# Altium schematic sheet CW342_FPGAIO_1.SchDoc: <Enter Sheet Title>
size Letter; Organization: NewAE Technology Inc.; Address1: 1083 Queen St., Suite 196; Address2: Halifax; Address3: NS; Address4: Canada B3H 0B2; SheetNumber: 3; SheetTotal: 9; SheetApproved: NO
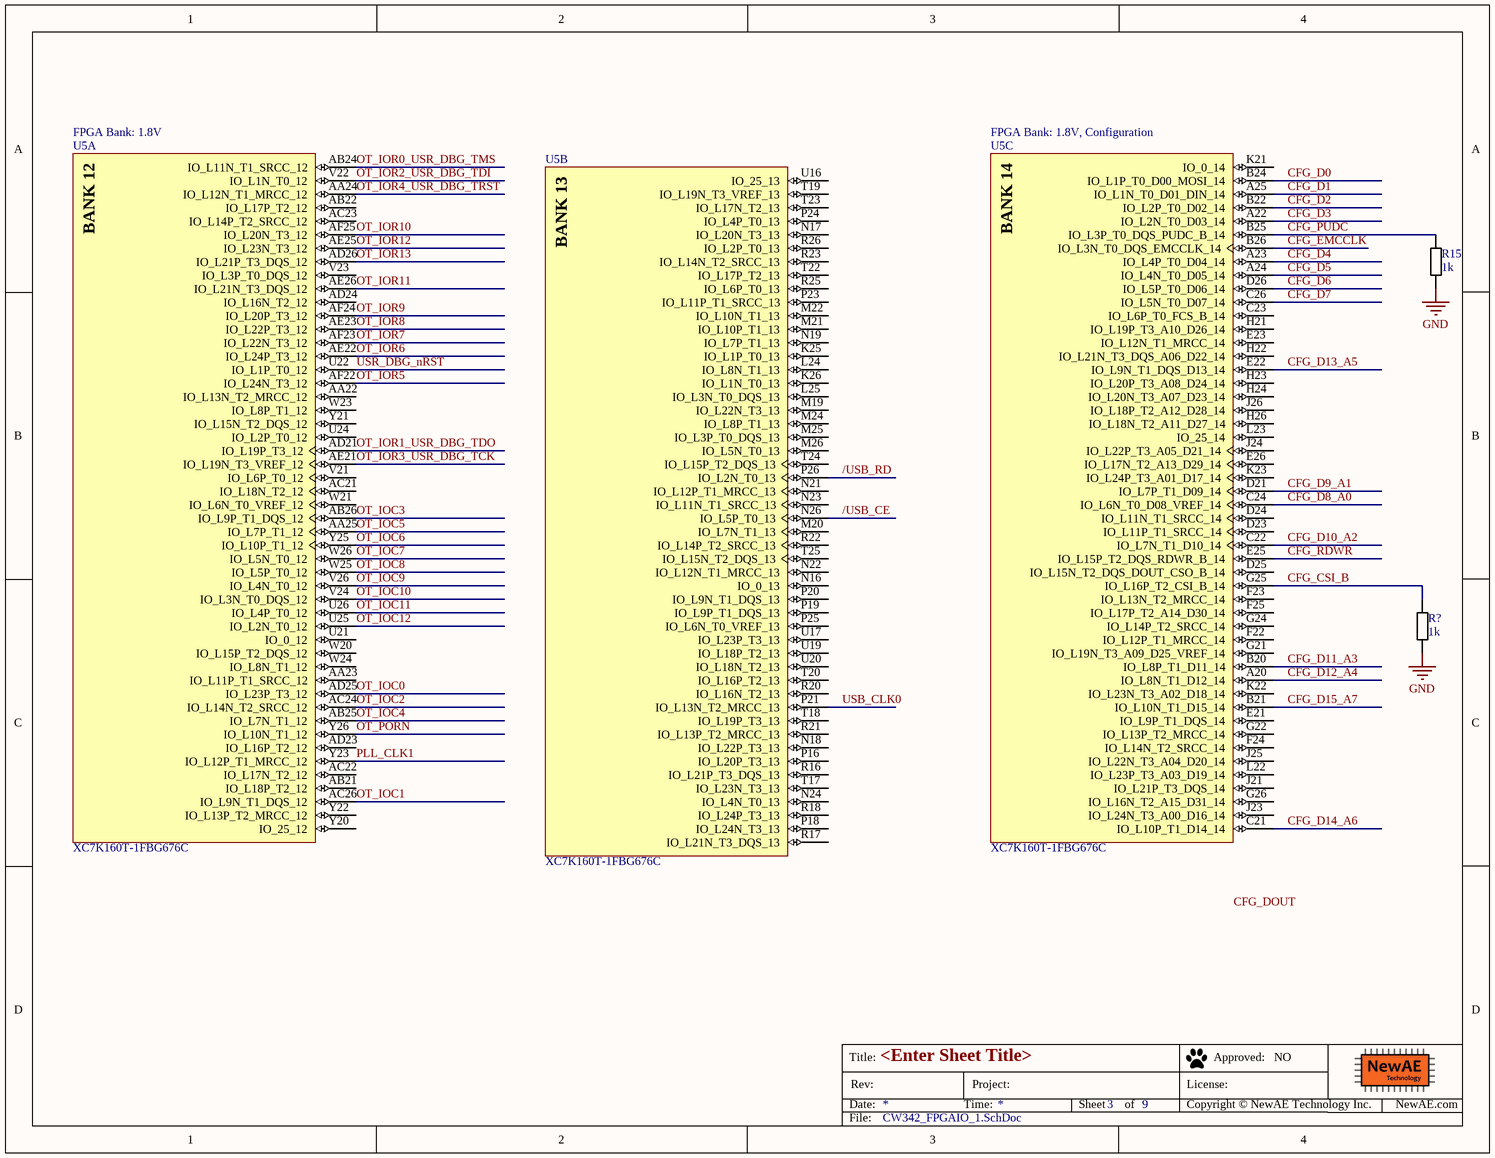
[diagram p0: CW342_FPGAIO_1.SchDoc]

## Parts
R15  1k  [RESC1005X40N]
R?  1k  [RESC1005X40N]
U5  XC7K160T-1FBG676C  [FBG676]  (parts A,B,C of 14)

## Nets
GND: R15.2 R?.2
/USB_CE: U5.N26(IO_L5P_T0_13)
/USB_RD: U5.P26(IO_L2N_T0_13)
CFG_CSI_B: R?.1 U5.G25(IO_L16P_T2_CSI_B_14)
CFG_D0: U5.B24(IO_L1P_T0_D00_MOSI_14)
CFG_D1: U5.A25(IO_L1N_T0_D01_DIN_14)
CFG_D2: U5.B22(IO_L2P_T0_D02_14)
CFG_D3: U5.A22(IO_L2N_T0_D03_14)
CFG_D4: U5.A23(IO_L4P_T0_D04_14)
CFG_D5: U5.A24(IO_L4N_T0_D05_14)
CFG_D6: U5.D26(IO_L5P_T0_D06_14)
CFG_D7: U5.C26(IO_L5N_T0_D07_14)
CFG_D8_A0: U5.C24(IO_L6N_T0_D08_VREF_14)
CFG_D9_A1: U5.D21(IO_L7P_T1_D09_14)
CFG_D10_A2: U5.C22(IO_L7N_T1_D10_14)
CFG_D11_A3: U5.B20(IO_L8P_T1_D11_14)
CFG_D12_A4: U5.A20(IO_L8N_T1_D12_14)
CFG_D13_A5: U5.E22(IO_L9N_T1_DQS_D13_14)
CFG_D14_A6: U5.C21(IO_L10P_T1_D14_14)
CFG_D15_A7: U5.B21(IO_L10N_T1_D15_14)
CFG_EMCCLK: U5.B26(IO_L3N_T0_DQS_EMCCLK_14)
CFG_PUDC: R15.1 U5.B25(IO_L3P_T0_DQS_PUDC_B_14)
CFG_RDWR: U5.E25(IO_L15P_T2_DQS_RDWR_B_14)
OT_IOC0: U5.AD25(IO_L23P_T3_12)
OT_IOC1: U5.AC26(IO_L9N_T1_DQS_12)
OT_IOC2: U5.AC24(IO_L14N_T2_SRCC_12)
OT_IOC3: U5.AB26(IO_L9P_T1_DQS_12)
OT_IOC4: U5.AB25(IO_L7N_T1_12)
OT_IOC5: U5.AA25(IO_L7P_T1_12)
OT_IOC6: U5.Y25(IO_L10P_T1_12)
OT_IOC7: U5.W26(IO_L5N_T0_12)
OT_IOC8: U5.W25(IO_L5P_T0_12)
OT_IOC9: U5.V26(IO_L4N_T0_12)
OT_IOC10: U5.V24(IO_L3N_T0_DQS_12)
OT_IOC11: U5.U26(IO_L4P_T0_12)
OT_IOC12: U5.U25(IO_L2N_T0_12)
OT_IOR0_USR_DBG_TMS: U5.AB24(IO_L11N_T1_SRCC_12)
OT_IOR1_USR_DBG_TDO: U5.AD21(IO_L19P_T3_12)
OT_IOR2_USR_DBG_TDI: U5.V22(IO_L1N_T0_12)
OT_IOR3_USR_DBG_TCK: U5.AE21(IO_L19N_T3_VREF_12)
OT_IOR4_USR_DBG_TRST: U5.AA24(IO_L12N_T1_MRCC_12)
OT_IOR5: U5.AF22(IO_L24N_T3_12)
OT_IOR6: U5.AE22(IO_L24P_T3_12)
OT_IOR7: U5.AF23(IO_L22N_T3_12)
OT_IOR8: U5.AE23(IO_L22P_T3_12)
OT_IOR9: U5.AF24(IO_L20P_T3_12)
OT_IOR10: U5.AF25(IO_L20N_T3_12)
OT_IOR11: U5.AE26(IO_L21N_T3_DQS_12)
OT_IOR12: U5.AE25(IO_L23N_T3_12)
OT_IOR13: U5.AD26(IO_L21P_T3_DQS_12)
OT_PORN: U5.Y26(IO_L10N_T1_12)
PLL_CLK1: U5.Y23(IO_L12P_T1_MRCC_12)
USB_CLK0: U5.P21(IO_L13N_T2_MRCC_13)
USR_DBG_nRST: U5.U22(IO_L1P_T0_12)

Not connected (* = marked no-connect by the designer): U5 AA22(IO_L13N_T2_MRCC_12) AA23(IO_L11P_T1_SRCC_12) AB21(IO_L18P_T2_12) AB22(IO_L17P_T2_12) AC21(IO_L18N_T2_12) AC22(IO_L17N_T2_12) AC23(IO_L14P_T2_SRCC_12) AD23(IO_L16P_T2_12) AD24(IO_L16N_T2_12) C23(IO_L6P_T0_FCS_B_14) D23(IO_L11P_T1_SRCC_14) D24(IO_L11N_T1_SRCC_14) D25(IO_L15N_T2_DQS_DOUT_CSO_B_14) E21(IO_L9P_T1_DQS_14) E23(IO_L12N_T1_MRCC_14) E26(IO_L17N_T2_A13_D29_14) F22(IO_L12P_T1_MRCC_14) F23(IO_L13N_T2_MRCC_14) F24(IO_L14N_T2_SRCC_14) F25(IO_L17P_T2_A14_D30_14) G21(IO_L19N_T3_A09_D25_VREF_14) G22(IO_L13P_T2_MRCC_14) G24(IO_L14P_T2_SRCC_14) G26(IO_L16N_T2_A15_D31_14) H21(IO_L19P_T3_A10_D26_14) H22(IO_L21N_T3_DQS_A06_D22_14) H23(IO_L20P_T3_A08_D24_14) H24(IO_L20N_T3_A07_D23_14) H26(IO_L18N_T2_A11_D27_14) J21(IO_L21P_T3_DQS_14) J23(IO_L24N_T3_A00_D16_14) J24(IO_L22P_T3_A05_D21_14) J25(IO_L22N_T3_A04_D20_14) J26(IO_L18P_T2_A12_D28_14) K21(IO_0_14) K22(IO_L23N_T3_A02_D18_14) K23(IO_L24P_T3_A01_D17_14) K25(IO_L1P_T0_13) K26(IO_L1N_T0_13) L22(IO_L23P_T3_A03_D19_14) L23(IO_25_14) L24(IO_L8N_T1_13) L25(IO_L3N_T0_DQS_13) M19(IO_L22N_T3_13) M20(IO_L7N_T1_13) M21(IO_L10P_T1_13) M22(IO_L10N_T1_13) M24(IO_L8P_T1_13) M25(IO_L3P_T0_DQS_13) M26(IO_L5N_T0_13) N16(IO_0_13) N17(IO_L20N_T3_13) N18(IO_L22P_T3_13) N19(IO_L7P_T1_13) N21(IO_L12P_T1_MRCC_13) N22(IO_L12N_T1_MRCC_13) N23(IO_L11N_T1_SRCC_13) N24(IO_L4N_T0_13) P16(IO_L20P_T3_13) P18(IO_L24N_T3_13) P19(IO_L9P_T1_DQS_13) P20(IO_L9N_T1_DQS_13) P23(IO_L11P_T1_SRCC_13) P24(IO_L4P_T0_13) P25(IO_L6N_T0_VREF_13) R16(IO_L21P_T3_DQS_13) R17(IO_L21N_T3_DQS_13) R18(IO_L24P_T3_13) R20(IO_L16N_T2_13) R21(IO_L13P_T2_MRCC_13) R22(IO_L14P_T2_SRCC_13) R23(IO_L14N_T2_SRCC_13) R25(IO_L6P_T0_13) R26(IO_L2P_T0_13) T17(IO_L23N_T3_13) T18(IO_L19P_T3_13) T19(IO_L19N_T3_VREF_13) T20(IO_L16P_T2_13) T22(IO_L17P_T2_13) T23(IO_L17N_T2_13) T24(IO_L15P_T2_DQS_13) T25(IO_L15N_T2_DQS_13) U16(IO_25_13) U17(IO_L23P_T3_13) U19(IO_L18P_T2_13) U20(IO_L18N_T2_13) U21(IO_0_12) U24(IO_L2P_T0_12) V21(IO_L6P_T0_12) V23(IO_L3P_T0_DQS_12) W20(IO_L15P_T2_DQS_12) W21(IO_L6N_T0_VREF_12) W23(IO_L8P_T1_12) W24(IO_L8N_T1_12) Y20(IO_25_12) Y21(IO_L15N_T2_DQS_12) Y22(IO_L13P_T2_MRCC_12)

## Notes on the sheet
- FPGA Bank: 1.8V
- FPGA Bank: 1.8V, Configuration
- Labels drawn without touching a wire or pin: CFG_DOUT
- Title:
- Date:
- Rev:
- Time:
- Project:
- Sheet
- of
- License:
- Copyright © NewAE Technology Inc.
- Approved:
- NewAE.com
- File:
- (in symbol CMP-0361-00025-2, part A) BANK 12
- (in symbol CMP-0361-00025-2, part B) BANK 13
- (in symbol CMP-0361-00025-2, part C) BANK 14

## Library data of the parts
R15 R? = RCHIP-1K-0402: 1k res, 0402, 1%, 1/16W; Manufacture 1: Yageo; Manufacture Part Number 1: RC0402FR-071KL; Component Group: Resistor; Case-EIA: 0402; Case-Metric: 1005; Rated Power: 0.063W; Rated Voltage: 75VDC; Part Number: RCHIP-1K-0402; Footprint: 0402; Pin Count: 2; Supplier 1: Digi-Key; Supplier Part Number 1: 311-1.00KLRCT-ND; Value: 1k; Tolerance: 1%; Mounting Technology: SMT; Temperature Range: -55C to 155C; Component Kind: Standard; Component Type: Standard
U5 = CMP-0361-00025-2: Kintex-7 FPGA, 400 User I/Os, 8 GTX, 676-Ball BGA, Speed Grade 1, Commercial Grade, Pb-Free; Manufacturer: Xilinx; SelectIO HR: 250; GTX: 8; SelectIO HP: 150; Speed Grade: -1; RoHS: Pb-Free; PackageReference: FBG676; Code_JEDEC: MS-034; Mounting Technology: Surface Mount; ComponentLink1URL: http://www.xilinx.com/support/documentation/data_sheets/ds180_7Series_Overview.pdf; DatasheetVersion: v1.12; Generic Part Number: XC7K160T; PartNumber: XC7K160T-1FBG676C; PackageVersion: Rev 1.8; ComponentLink2URL: http://www.xilinx.com/support/documentation/user_guides/ug475_7Series_Pkg_Pinout.pdf; PackageDescription: Flip-Chip Lidless BGA, Body 27 x 27 mm, 1.0 mm Pitch; ComponentLink1Description: Datasheet; ComponentLink2Description: Package Specification